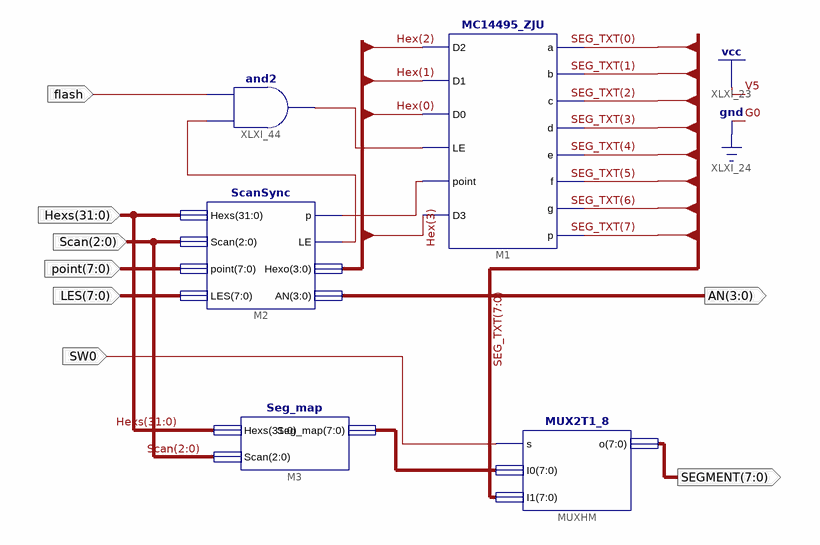
[diagram p0: schematic sheet 1]
// Xilinx ISE schematic Seg7_Dev.sch (kintex7) as structural Verilog: 5 symbols, 8 ports
module Seg7_Dev (
  input  flash,
  input  [7:0] point,
  input  [7:0] LES,
  input  SW0,
  input  [31:0] Hexs,
  input  [2:0] Scan,
  output [3:0] AN,
  output [7:0] SEGMENT
);

  wire XLXN_271, XLXN_417, XLXN_418;
  wire [3:0] Hex;
  wire [7:0] SEG_TXT, XLXN_416;

  MC14495_ZJU M1 (
    .D2(Hex[2]), .D1(Hex[1]), .D0(Hex[0]), .LE(XLXN_417), .point(XLXN_271), .D3(Hex[3]), .a(SEG_TXT[0]),
    .b(SEG_TXT[1]), .c(SEG_TXT[2]), .d(SEG_TXT[3]), .e(SEG_TXT[4]), .f(SEG_TXT[5]), .g(SEG_TXT[6]),
    .p(SEG_TXT[7]));
  ScanSync M2 (.Hexs(Hexs), .Scan(Scan), .point(point), .LES(LES), .p(XLXN_271), .LE(XLXN_418), .Hexo(Hex), .AN(AN));
  and XLXI_44 (XLXN_417, XLXN_418, flash);
  Seg_map M3 (.Hexs(Hexs), .Scan(Scan), .Seg_map(XLXN_416));
  MUX2T1_8 MUXHM (.s(SW0), .I0(XLXN_416), .I1(SEG_TXT), .o(SEGMENT));
endmodule
